# Altium schematic sheet Main.SchDoc
size 419 x 322 mm; SheetNumber: 1
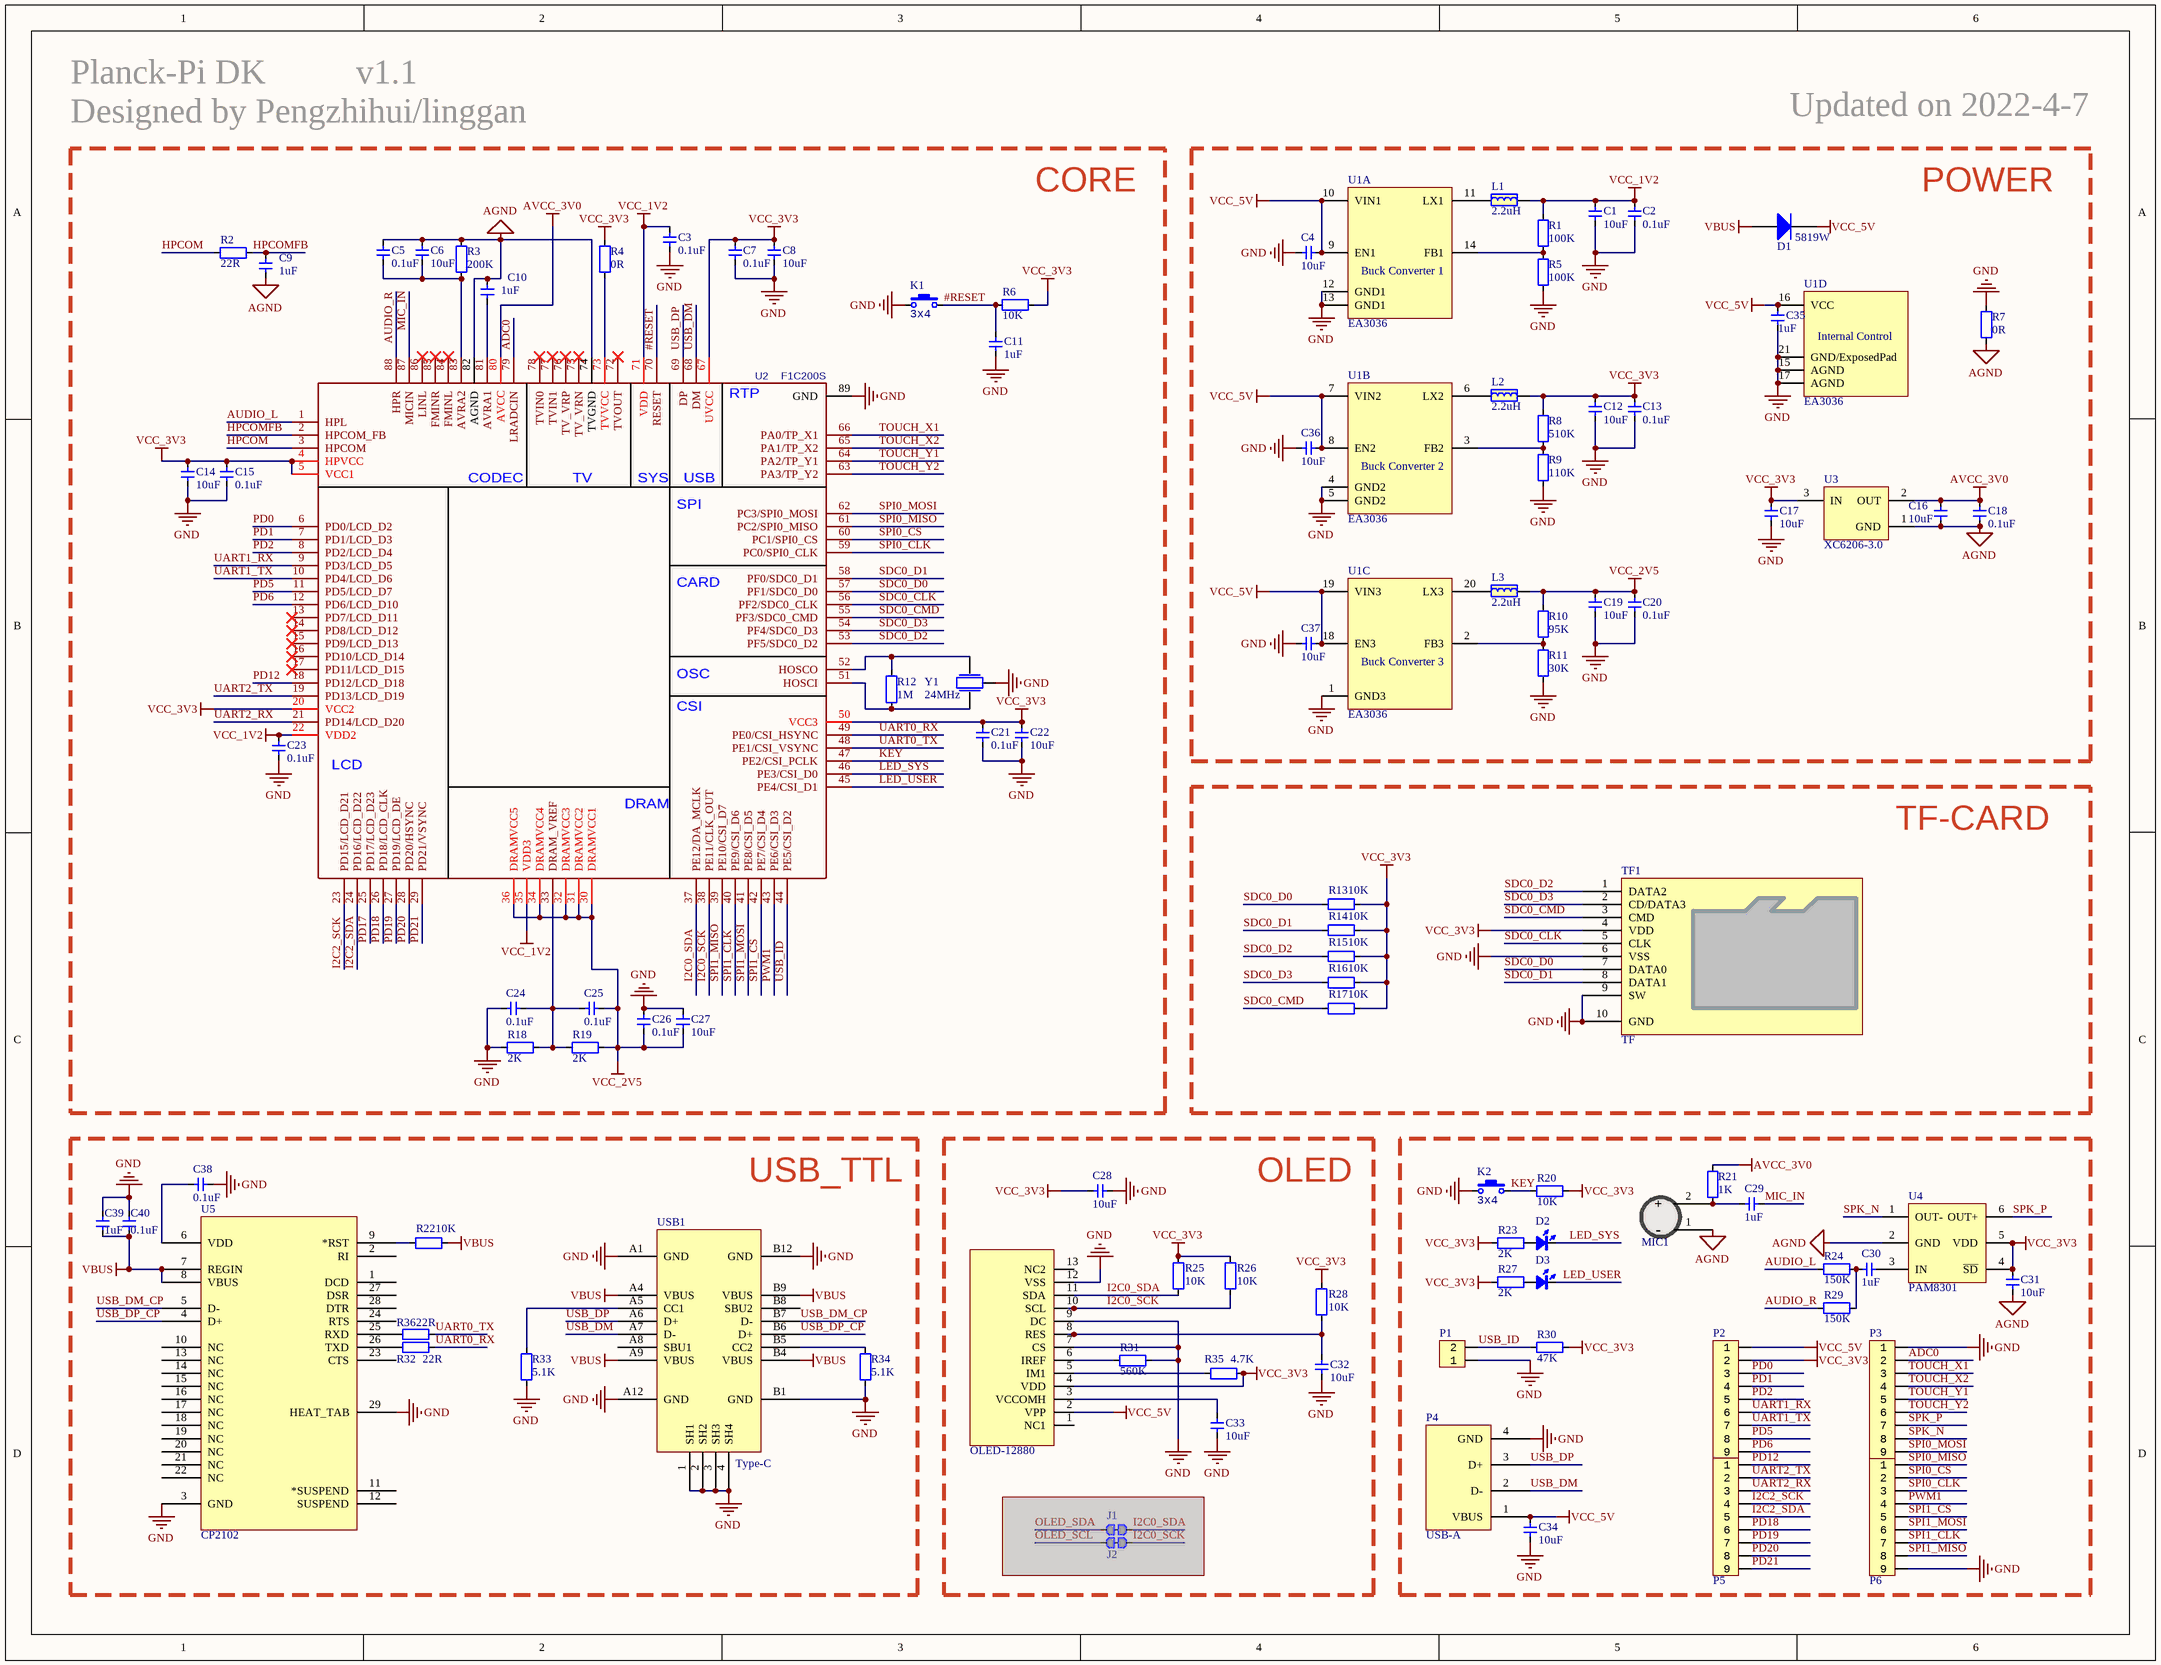
[diagram p0: Main.SchDoc]

## Parts
1  OLED-12880  [OLED-12880]
C1  10uF  [CAP_0402]
C2  0.1uF  [CAP_0402]
C3  0.1uF  [CAP_0402]
C4  10uF  [CAP_0402]
C5  0.1uF  [CAP_0402]
C6  10uF  [CAP_0402]
C7  0.1uF  [CAP_0402]
C8  10uF  [CAP_0402]
C9  1uF  [CAP_0402]
C10  1uF  [CAP_0402]
C11  1uF  [CAP_0402]
C12  10uF  [CAP_0402]
C13  0.1uF  [CAP_0402]
C14  10uF  [CAP_0402]
C15  0.1uF  [CAP_0402]
C16  10uF  [CAP_0402]
C17  10uF  [CAP_0402]
C18  0.1uF  [CAP_0402]
C19  10uF  [CAP_0402]
C20  0.1uF  [CAP_0402]
C21  0.1uF  [CAP_0402]
C22  10uF  [CAP_0402]
C23  0.1uF  [CAP_0402]
C24  0.1uF  [CAP_0402]
C25  0.1uF  [CAP_0402]
C26  0.1uF  [CAP_0402]
C27  10uF  [CAP_0402]
C28  10uF  [CAP_0402]
C29  1uF  [CAP_0402]
C30  1uF  [CAP_0402]
C31  10uF  [CAP_0402]
C32  10uF  [CAP_0402]
C33  10uF  [CAP_0402]
C34  10uF  [CAP_0402]
C35  1uF  [CAP_0402]
C36  10uF  [CAP_0402]
C37  10uF  [CAP_0402]
C38  0.1uF  [CAP_0402]
C39  1uF  [CAP_0402]
C40  0.1uF  [CAP_0402]
D1  5819W  [SOD-323]
D2  LED_R  [LED_0402_RED]  (value not drawn)
D3  LED_R  [LED_0402_RED]  (value not drawn)
J1  0R  [RES_0402]  (value not drawn)  (masked out: inside a compile mask, not in the netlist)
J2  0R  [RES_0402]  (value not drawn)  (masked out: inside a compile mask, not in the netlist)
K1  value 3x4  [ButtonTACT_3x4x2_180]  (hidden comment: KEY)
K2  value 3x4  [ButtonTACT_3x4x2_180]  (hidden comment: KEY)
L1  2.2uH  [2520-L]
L2  2.2uH  [2520-L]
L3  2.2uH  [2520-L]
MIC1  MIC  [MIC-SMT]  (value not drawn)
P1  DIP 1x2  [HDR1X2_2.54_180]  (value not drawn)
P2  HDR1x9.54  [HDR1X9_2.54_180]  (value not drawn)
P3  HDR1x9.54  [HDR1X9_2.54_180]  (value not drawn)
P4  USB-A  [USB-Short]
P5  HDR1x9.54  [HDR1X9_2.54_180]  (value not drawn)
P6  HDR1x9.54  [HDR1X9_2.54_180]  (value not drawn)
R1  100K  [RES_0402]
R2  22R  [RES_0402]
R3  200K  [RES_0402]
R4  0R  [RES_0402]
R5  100K  [RES_0402]
R6  10K  [RES_0402]
R7  0R  [RES_0402]
R8  510K  [RES_0402]
R9  110K  [RES_0402]
R10  95K  [RES_0402]
R11  30K  [RES_0402]
R12  1M  [RES_0402]
R13  10K  [RES_0402]
R14  10K  [RES_0402]
R15  10K  [RES_0402]
R16  10K  [RES_0402]
R17  10K  [RES_0402]
R18  2K  [RES_0402]
R19  2K  [RES_0402]
R20  10K  [RES_0402]
R21  1K  [RES_0402]
R22  10K  [RES_0402]
R23  2K  [RES_0402]
R24  150K  [RES_0402]
R25  10K  [RES_0402]
R26  10K  [RES_0402]
R27  2K  [RES_0402]
R28  10K  [RES_0402]
R29  150K  [RES_0402]
R30  47K  [RES_0402]
R31  560K  [RES_0402]
R32  22R  [RES_0402]
R33  5.1K  [RES_0402]
R34  5.1K  [RES_0402]
R35  4.7K  [RES_0402]
R36  22R  [RES_0402]
TF1  TF  [TF-SOCKET]
U1  EA3036  [QFN-20]  (parts A,B,C,D of 4)
U2  F1C200S  [QFN-88-0.4MM]
U3  XC6206-3.0  [SOT23-3]
U4  PAM8301  [SOT23-6]
U5  CP2102  [QFN-28]
USB1  Type-C  [Type-C-TOP]
Y1  24MHz  [晶振-3P]

## Blocks framed on the sheet
CORE: C3 C5-C11 C14 C15 C21-C27 K1 R2-R4 R6 R12 R18 R19 U2 Y1
POWER: C1 C2 C4 C12 C13 C16-C20 C35-C37 D1 L1-L3 R1 R5 R7-R11 U1 U3
TF-CARD: R13-R17 TF1
USB_TTL: C38-C40 R22 R32-R34 R36 U5 USB1
OLED: 1 C28 C32 C33 J1 J2 R25 R26 R28 R31 R35

## Nets
AGND: C5.1 C6.1 C9.2 C10.1 C16.1 C18.1 C31.2 MIC1.1(-) R3.2 R7.1 U2.74(TVGND) U2.82(AGND) U3.1(GND) U4.2(GND)
AVCC_3V0: C16.2 C18.2 R21.1 U2.80(AVCC) U3.2(OUT)
GND: 1.7(CS) 1.9(DC) 1.12(VSS) C1.2 C2.2 C3.1 C4.1 C7.2 C8.2 C11.1 C12.2 C13.2 C14.1 C15.1 C17.2 C19.2 C20.2 C21.2 C22.2 C23.1 C24.1 C26.1 C27.2 C28.1 C32.1 C33.1 C34.1 C35.2 C36.2 C37.2 C38.2 C39.2 C40.2 K1.1 K2.1 P1.1 P3.1 P4.4(GND) P6.9 R5.1 R7.2 R9.1 R11.1 R18.2 R31.2 R33.2 R34.2 TF1.6(VSS) TF1.9(SW) TF1.10(GND) U1.1(GND3) U1.4(GND2) U1.5(GND2) U1.12(GND1) U1.13(GND1) U1.15(AGND) U1.17(AGND) U1.21(GND/ExposedPad) U2.89(GND) U5.3(GND) U5.29(HEAT_TAB) USB1.1(SH1) USB1.2(SH2) USB1.3(SH3) USB1.4(SH4) USB1.A1(GND) USB1.A12(GND) USB1.B1(GND) USB1.B12(GND) Y1.2
VBUS: C39.1 C40.1 D1.2 R22.1 U5.7(REGIN) U5.8(VBUS) USB1.A4(VBUS) USB1.A9(VBUS) USB1.B4(VBUS) USB1.B9(VBUS)
VCC_1V2: C1.1 C2.1 C3.2 C23.2 L1.2 R1.2 U2.22(VDD2) U2.35(VDD3) U2.71(VDD)
VCC_2V5: C19.1 C20.1 C25.2 C26.2 C27.1 L3.2 R10.2 R19.1 U2.30(DRAMVCC1) U2.31(DRAMVCC2) U2.32(DRAMVCC3) U2.34(DRAMVCC4) U2.36(DRAMVCC5)
VCC_3V3: 1.4(VDD) C7.1 C8.1 C12.1 C13.1 C14.2 C15.2 C17.1 C21.1 C22.1 C28.2 C31.1 L2.2 P2.2 R4.2 R6.2 R8.2 R13.1 R14.1 R15.1 R16.1 R17.1 R20.1 R23.2 R25.2 R26.2 R27.2 R28.2 R30.1 R35.2 TF1.4(VDD) U2.4(HPVCC) U2.5(VCC1) U2.20(VCC2) U2.50(VCC3) U2.67(UVCC) U3.3(IN) U4.4(~{SD}) U4.5(VDD)
VCC_5V: 1.2(VPP) C4.2 C34.2 C35.1 C36.1 C37.1 D1.1 P2.1 P4.1(VBUS) U1.7(VIN2) U1.8(EN2) U1.9(EN1) U1.10(VIN1) U1.16(VCC) U1.18(EN3) U1.19(VIN3)
#RESET: C11.2 K1.2 R6.1 U2.70(RESET)
ADC0: P3.2 U2.79(LRADCIN)
AUDIO_L: R24.1 U2.1(HPL)
AUDIO_R: R29.1 U2.88(HPR)
HPCOM: R2.2 U2.3(HPCOM)
HPCOMFB: C9.1 R2.1 U2.2(HPCOM_FB)
I2C0_SCK: 1.10(SCL) R26.1 U2.38(PE11/CLK_OUT)
I2C0_SDA: 1.11(SDA) R25.1 U2.37(PE12/DA_MCLK)
I2C2_SCK: P5.4 U2.23(PD15/LCD_D21)
I2C2_SDA: P5.5 U2.24(PD16/LCD_D22)
KEY: K2.2 R20.2 U2.47(PE2/CSI_PCLK)
LED_SYS: D2.2(K) U2.46(PE3/CSI_D0)
LED_USER: D3.2(K) U2.45(PE4/CSI_D1)
MIC_IN: C29.1 U2.87(MICIN)
PD0: P2.3 U2.6(PD0/LCD_D2)
PD1: P2.4 U2.7(PD1/LCD_D3)
PD2: P2.5 U2.8(PD2/LCD_D4)
PD5: P2.8 U2.11(PD5/LCD_D7)
PD6: P2.9 U2.12(PD6/LCD_D10)
PD12: P5.1 U2.18(PD12/LCD_D18)
PD17: U2.25(PD17/LCD_D23)
PD18: P5.6 U2.26(PD18/LCD_CLK)
PD19: P5.7 U2.27(PD19/LCD_DE)
PD20: P5.8 U2.28(PD20/HSYNC)
PD21: P5.9 U2.29(PD21/VSYNC)
PWM1: P6.4 U2.43(PE6/CSI_D3)
SDC0_CLK: TF1.5(CLK) U2.56(PF2/SDC0_CLK)
SDC0_CMD: R17.2 TF1.3(CMD) U2.55(PF3/SDC0_CMD)
SDC0_D0: R13.2 TF1.7(DATA0) U2.57(PF1/SDC0_D0)
SDC0_D1: R14.2 TF1.8(DATA1) U2.58(PF0/SDC0_D1)
SDC0_D2: R15.2 TF1.1(DATA2) U2.53(PF5/SDC0_D2)
SDC0_D3: R16.2 TF1.2(CD/DATA3) U2.54(PF4/SDC0_D3)
SPI0_CLK: P6.3 U2.59(PC0/SPI0_CLK)
SPI0_CS: P6.2 U2.60(PC1/SPI0_CS)
SPI0_MISO: P6.1 U2.61(PC2/SPI0_MISO)
SPI0_MOSI: P3.9 U2.62(PC3/SPI0_MOSI)
SPI1_CLK: P6.7 U2.40(PE9/CSI_D6)
SPI1_CS: P6.5 U2.42(PE7/CSI_D4)
SPI1_MISO: P6.8 U2.39(PE10/CSI_D7)
SPI1_MOSI: P6.6 U2.41(PE8/CSI_D5)
SPK_N: P3.8 U4.1(OUT-)
SPK_P: P3.7 U4.6(OUT+)
TOUCH_X1: P3.3 U2.66(PA0/TP_X1)
TOUCH_X2: P3.4 U2.65(PA1/TP_X2)
TOUCH_Y1: P3.5 U2.64(PA2/TP_Y1)
TOUCH_Y2: P3.6 U2.63(PA3/TP_Y2)
UART0_RX: R32.1 U2.49(PE0/CSI_HSYNC)
UART0_TX: R36.1 U2.48(PE1/CSI_VSYNC)
UART1_RX: P2.6 U2.9(PD3/LCD_D5)
UART1_TX: P2.7 U2.10(PD4/LCD_D6)
UART2_RX: P5.3 U2.21(PD14/LCD_D20)
UART2_TX: P5.2 U2.19(PD13/LCD_D19)
USB_DM: P4.2(D-) U2.68(DM) USB1.A7(D-)
USB_DM_CP: U5.5(D-) USB1.B7(D-)
USB_DP: P4.3(D+) U2.69(DP) USB1.A6(D+)
USB_DP_CP: U5.4(D+) USB1.B6(D+)
USB_ID: P1.2 R30.2 U2.44(PE5/CSI_D2)
Net1_3: 1.3(VCCOMH) C33.2
Net1_5: 1.5(IM1) R35.1
Net1_6: 1.6(IREF) R31.1
Net1_8: 1.8(RES) C32.2 R28.1
NetC5_2: C5.2 C6.2 R3.1 U2.83(AVRA2)
NetC10_2: C10.2 U2.81(AVRA1)
NetC24_2: C24.2 C25.1 R18.1 R19.2 U2.33(DRAM_VREF)
NetC29_2: C29.2 MIC1.2(+) R21.2
NetC30_1: C30.1 U4.3(IN)
NetC30_2: C30.2 R24.2 R29.2
NetC38_1: C38.1 U5.6(VDD)
NetD2_1: D2.1(A) R23.1
NetD3_1: D3.1(A) R27.1
NetL1_1: L1.1 U1.11(LX1)
NetL2_1: L2.1 U1.6(LX2)
NetL3_1: L3.1 U1.20(LX3)
NetR1_1: R1.1 R5.2 U1.14(FB1)
NetR4_1: R4.1 U2.73(TVVCC)
NetR8_1: R8.1 R9.2 U1.3(FB2)
NetR10_1: R10.1 R11.2 U1.2(FB3)
NetR12_1: R12.1 U2.51(HOSCI) Y1.3
NetR12_2: R12.2 U2.52(HOSCO) Y1.1
NetR22_2: R22.2 U5.9(*RST)
NetR32_2: R32.2 U5.26(TXD)
NetR33_1: R33.1 USB1.A5(CC1)
NetR34_1: R34.1 USB1.B5(CC2)
NetR36_2: R36.2 U5.25(RXD)

Not connected (* = marked no-connect by the designer): 1 1(NC1) 13(NC2); U2 13(PD7/LCD_D11)* 14(PD8/LCD_D12)* 15(PD9/LCD_D13)* 16(PD10/LCD_D14)* 17(PD11/LCD_D15)* 72(TVOUT)* 75(TV_VRN)* 76(TV_VRP)* 77(TVIN1)* 78(TVIN0)* 84(FMINL)* 85(FMINR)* 86(LINL)*; U5 1(DCD) 2(RI) 10(NC) 11(*SUSPEND) 12(SUSPEND) 13(NC) 14(NC) 15(NC) 16(NC) 17(NC) 18(NC) 19(NC) 20(NC) 21(NC) 22(NC) 23(CTS) 24(RTS) 27(DSR) 28(DTR); USB1 A8(SBU1) B8(SBU2)

## Notes on the sheet
- Planck-Pi DK          v1.1
  Designed by Pengzhihui/linggan
- Updated on 2022-4-7
- (in symbol EA3036, part A) Buck Converter 1
- (in symbol EA3036, part B) Buck Converter 2
- (in symbol EA3036, part C) Buck Converter 3
- (in symbol EA3036, part D) Internal Control
- (in symbol F1C200S) RTP; CODEC; TV; SYS; USB; SPI; CARD; OSC; CSI; LCD; DRAM

## Library data of the parts
C1-C40 = 电容-0402: Capacitor; Value: 0.1u
D1 = 二极管-5819W: 40V
D2 D3 = LED_0402: LED; Type: 0402; Value: color?
J1 J2 = 跳线: Resistor; Published: 8-Jun-2000; LatestRevisionDate: 17-Jul-2002; LatestRevisionNote: Re-released for DXP Platform.; PackageReference: AXIAL-0.4; Publisher: Altium Limited; PackageDescription: Axial Device, Thru-Hole; 2 Leads; 0.4 in Pin Spacing
K1 K2 = ButtonTACT_3x4x2_180: Button; type: TACT 2P
L1-L3 = 电感-2520: 磁珠
P1 = HDR1x2_2.54: Header; Value: 2.54; Type: DIP 1x2
P2 P3 P5 P6 = HDR1x9_2.54: Header
R1 R3-R31 R33-R35 = 电阻-0402: Resistor; Value: 22R
R2 R32 R36 = 电阻-0402: Resistor; Value: 22R
TF1 = TF卡座: 8脚自弹
U1 = EA3036: EA3036 is a 3CH power management IC for applications powered by one Li-Ion battery or a DC 5V adapter.
U2 = F1C200S: BOM_Manufacturer: Allwinner; Contributor: ChrisLan2018; BOM_Supplier: Allwinner; spicePre: U; spiceSymbolName: F1C200S
U3 = XC6206-3.0: LDO
U5 = CP2102: USB转TTL; PART DESC: SINGLE-CHIP USB TO UART BRIDGE, QFN28, RoHS.; MFG #1: SILICON LABS; PART NUMBER: CP2102; Value: Value; RefDes: RefDes; Type: DEV
USB1 = USB-Type-C-TOP
Y1 = 晶振-3Pin: 村田贴片